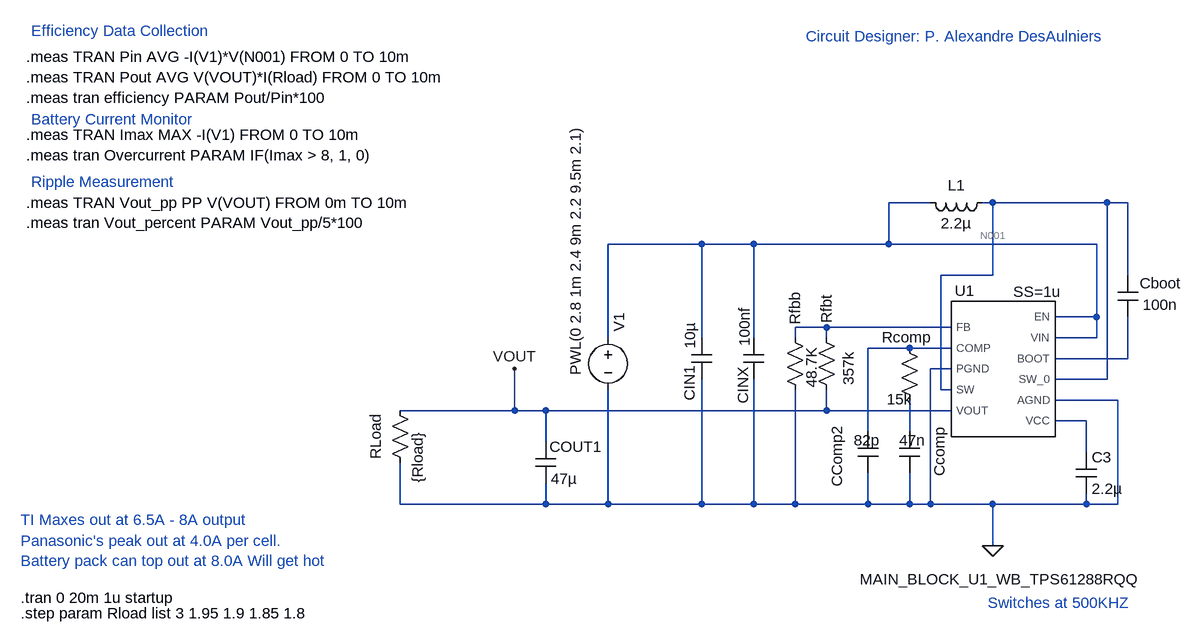
[diagram p0: schematic ECED3901_BOOST_CONVERTER_TI_FINAL.asc]
ECED3901_BOOST_CONVERTER_TI_FINAL.asc, the LTspice schematic file:
Version 4.1
SHEET 1 1132 680
WIRE -128 -240 -192 -240
WIRE -32 -240 -48 -240
WIRE 144 -240 -32 -240
WIRE 176 -240 144 -240
WIRE -480 -176 -624 -176
WIRE -400 -176 -480 -176
WIRE -192 -176 -192 -240
WIRE -192 -176 -400 -176
WIRE 128 -176 -192 -176
WIRE -32 -128 -32 -240
WIRE -32 -128 -112 -128
WIRE 176 -128 176 -240
WIRE 128 -64 128 -176
WIRE 128 -64 64 -64
WIRE -288 -48 -336 -48
WIRE -96 -48 -288 -48
WIRE -624 -32 -624 -176
WIRE -480 -32 -480 -176
WIRE -400 -32 -400 -176
WIRE -336 -32 -336 -48
WIRE -288 -32 -288 -48
WIRE 128 -32 128 -64
WIRE 128 -32 64 -32
WIRE -160 -16 -224 -16
WIRE -96 -16 -160 -16
WIRE 176 0 176 -64
WIRE 176 0 64 0
WIRE -96 16 -128 16
WIRE 144 32 144 -240
WIRE 144 32 64 32
WIRE -112 48 -112 -128
WIRE -96 48 -112 48
WIRE 160 64 64 64
WIRE -768 80 -768 16
WIRE -768 80 -944 80
WIRE -720 80 -768 80
WIRE -288 80 -288 48
WIRE -288 80 -720 80
WIRE -96 80 -288 80
WIRE 112 96 64 96
WIRE -224 112 -224 -16
WIRE -160 112 -160 64
WIRE -720 128 -720 80
WIRE 112 144 112 96
WIRE -944 224 -944 160
WIRE -720 224 -720 192
WIRE -720 224 -944 224
WIRE -624 224 -624 48
WIRE -624 224 -720 224
WIRE -480 224 -480 32
WIRE -480 224 -624 224
WIRE -400 224 -400 32
WIRE -400 224 -480 224
WIRE -336 224 -336 48
WIRE -336 224 -400 224
WIRE -224 224 -224 176
WIRE -224 224 -336 224
WIRE -160 224 -160 176
WIRE -160 224 -224 224
WIRE -128 224 -128 16
WIRE -128 224 -160 224
WIRE -32 224 -128 224
WIRE 112 224 112 208
WIRE 112 224 -32 224
WIRE 160 224 160 64
WIRE 160 224 112 224
WIRE -32 288 -32 224
FLAG -32 288 0
FLAG -768 16 VOUT
SYMBOL MAIN_BLOCK_U1_WB_TPS61288RQQ_ERROR_AMP -16 16 R0
WINDOW 0 -59 -105 Bottom 2
WINDOW 3 -4 308 Top 2
WINDOW 39 52 -134 Top 2
SYMATTR InstName U1
SYMATTR SpiceLine SS=1u
SYMBOL voltage -624 -48 R0
WINDOW 123 0 0 Left 0
WINDOW 39 0 0 Left 0
WINDOW 0 17 7 VLeft 2
WINDOW 3 -50 74 VLeft 2
SYMATTR InstName V1
SYMATTR Value PWL(0 2.8 1m 2.4 9m 2.2 9.5m 2.1)
SYMBOL cap -496 -32 R0
WINDOW 3 -2 -23 VRight 2
WINDOW 0 -3 42 VRight 2
SYMATTR Value 10µ
SYMATTR InstName CIN1
SYMBOL cap -416 -32 R0
WINDOW 3 2 -47 VRight 2
WINDOW 0 0 45 VRight 2
SYMATTR Value 100nf
SYMATTR InstName CINX
SYMBOL cap 96 144 R0
SYMATTR InstName C3
SYMATTR Value 2.2µ
SYMBOL ind -32 -256 R90
WINDOW 0 5 56 VBottom 2
WINDOW 3 32 56 VTop 2
SYMATTR InstName L1
SYMATTR Value 2.2µ
SYMATTR SpiceLine Rser=20m
SYMBOL cap 160 -128 R0
WINDOW 0 34 12 Left 2
WINDOW 3 39 45 Left 2
SYMATTR InstName Cboot
SYMATTR Value 100n
SYMBOL res -304 -48 R0
WINDOW 0 16 -6 VLeft 2
WINDOW 3 50 37 VRight 2
SYMATTR InstName Rfbt
SYMATTR Value 357k
SYMBOL res -352 -48 R0
WINDOW 0 16 -4 VLeft 2
WINDOW 3 41 31 VRight 2
SYMATTR InstName Rfbb
SYMATTR Value 48.7K
SYMBOL res -176 -32 R0
WINDOW 0 -27 -1 Left 2
WINDOW 3 -19 95 Left 2
SYMATTR InstName Rcomp
SYMATTR Value 15k
SYMBOL cap -176 112 R0
WINDOW 0 62 -7 VRight 2
WINDOW 3 0 14 Left 2
SYMATTR InstName Ccomp
SYMATTR Value 47n
SYMBOL cap -240 112 R0
WINDOW 0 -32 -9 VRight 2
WINDOW 3 -6 14 Left 2
SYMATTR InstName CComp2
SYMATTR Value 82p
SYMBOL cap -736 128 R0
WINDOW 0 22 8 Left 2
WINDOW 3 24 57 Left 2
SYMATTR InstName COUT1
SYMATTR Value 47µ
SYMATTR SpiceLine Rser=10m
SYMBOL res -960 64 R0
WINDOW 0 -22 20 VRight 2
WINDOW 3 43 48 VRight 2
SYMATTR InstName RLoad
SYMATTR Value {Rload}
TEXT -1528 368 Left 2 !.tran 0 20m 1u startup
TEXT -40 376 Left 2 ;Switches at 500KHZ
TEXT -1528 248 Left 2 ;TI Maxes out at 6.5A - 8A output
TEXT -1528 280 Left 2 ;Panasonic's peak out at 4.0A per cell.\nBattery pack can top out at 8.0A Will get hot
TEXT -1520 -464 Left 2 !.meas TRAN Pin AVG -I(V1)*V(N001) FROM 0 TO 10m\n.meas TRAN Pout AVG V(VOUT)*I(Rload) FROM 0 TO 10m\n.meas tran efficiency PARAM Pout/Pin*100
TEXT -1520 -344 Left 2 !.meas TRAN Imax MAX -I(V1) FROM 0 TO 10m\n.meas tran Overcurrent PARAM IF(Imax > 8, 1, 0)
TEXT -1528 392 Left 2 !.step param Rload list 3 1.95 1.9 1.85 1.8
TEXT -1520 -240 Left 2 !.meas TRAN Vout_pp PP V(VOUT) FROM 0m TO 10m\n.meas tran Vout_percent PARAM Vout_pp/5*100
TEXT -1512 -272 Left 2 ;Ripple Measurement
TEXT -1512 -368 Left 2 ;Battery Current Monitor
TEXT -1512 -504 Left 2 ;Efficiency Data Collection
TEXT -320 -496 Left 2 ;Circuit Designer: P. Alexandre DesAulniers

The netlist it stands for:
* ECED3901_BOOST_CONVERTER_TI_FINAL.asc
X§U1 N003 N004 0 N002 VOUT N001 N001 N005 N002 0 N006 MAIN_BLOCK_U1_WB_TPS61288RQQ SS=1u  ; pins FB COMP PGND SW VOUT EN VIN BOOT SW_0 AGND VCC
V1 N001 0 PWL(0 2.8 1m 2.4 9m 2.2 9.5m 2.1)
CIN1 N001 0 10µ
CINX N001 0 100nf
C3 N006 0 2.2µ
L1 N002 N001 2.2µ Rser=20m
Cboot N002 N005 100n
Rfbt N003 VOUT 357k
Rfbb N003 0 48.7K
Rcomp N004 N007 15k
Ccomp N007 0 47n
CComp2 N004 0 82p
COUT1 VOUT 0 47µ Rser=10m
RLoad VOUT 0 {Rload}
.tran 0 20m 1u startup
* Switches at 500KHZ
* TI Maxes out at 6.5A - 8A output
* Panasonic's peak out at 4.0A per cell.
* Battery pack can top out at 8.0A Will get hot
.meas TRAN Pin AVG -I(V1)*V(N001) FROM 0 TO 10m
.meas TRAN Pout AVG V(VOUT)*I(Rload) FROM 0 TO 10m
.meas tran efficiency PARAM Pout/Pin*100
.meas TRAN Imax MAX -I(V1) FROM 0 TO 10m
.meas tran Overcurrent PARAM IF(Imax > 8, 1, 0)
.step param Rload list 3 1.95 1.9 1.85 1.8
.meas TRAN Vout_pp PP V(VOUT) FROM 0m TO 10m
.meas tran Vout_percent PARAM Vout_pp/5*100
* Ripple Measurement
* Battery Current Monitor
* Efficiency Data Collection
* Circuit Designer: P. Alexandre DesAulniers
.lib Z:\home\desau\Downloads\WBDesign1_TINA-TI\WEBENCH_DESIGN_18632005_1.CIR
.backanno
.end